# Altium project Current Sense.PrjPcb
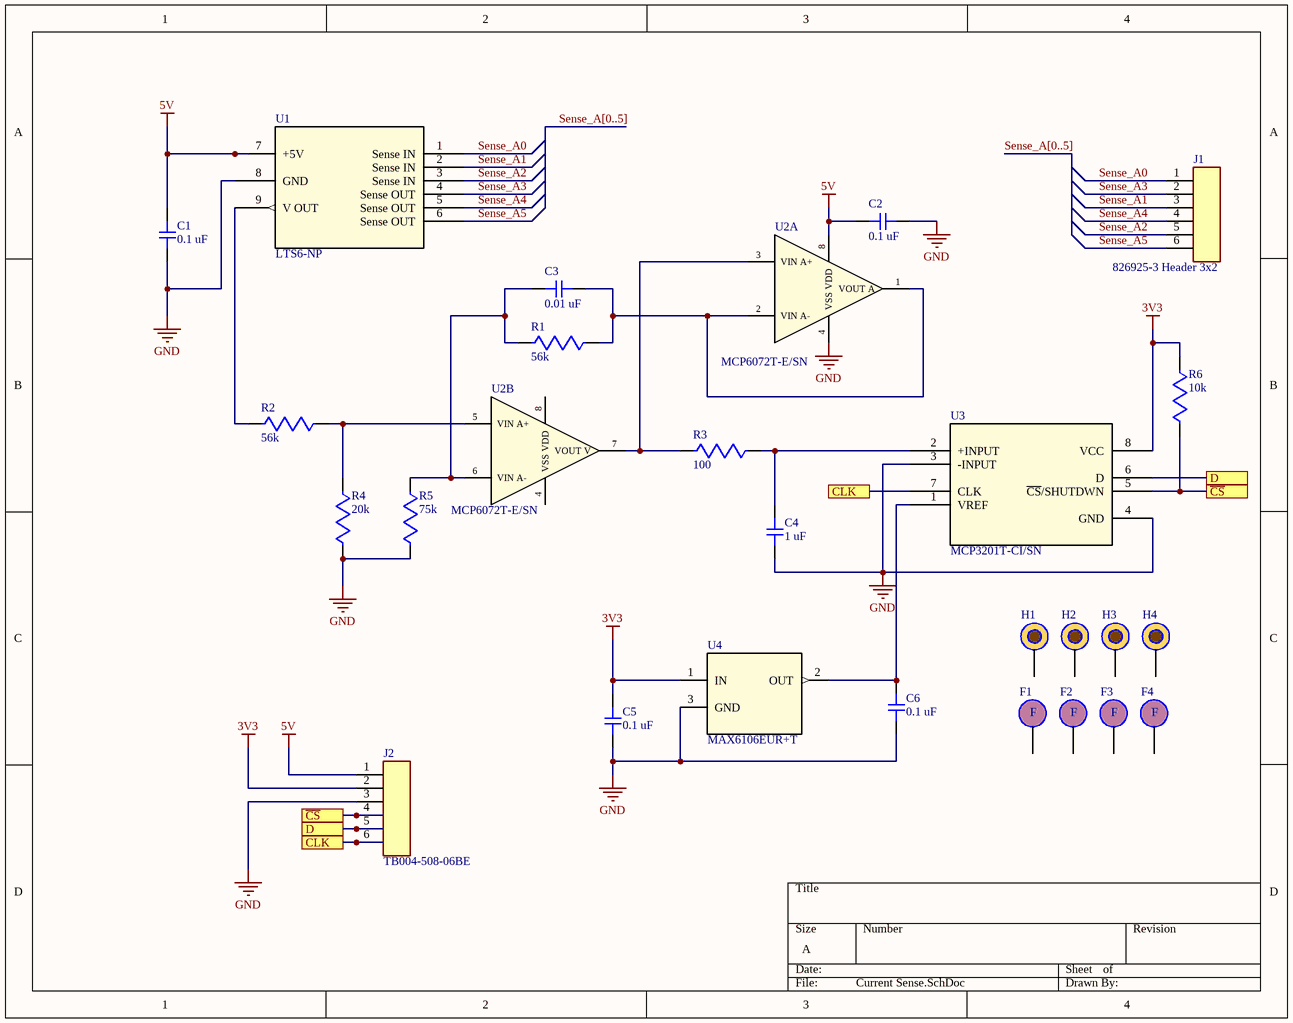
[diagram p0: Current Sense.SchDoc]
1 sheet, 26 parts. Net scope: flat (ports and power ports of the same name join across sheets).
Board file: Current Sense.PcbDoc

## Sheet Current Sense.SchDoc
size A

### Parts
C1  0.1 uF  [C0805E]
C2  0.1 uF  [C0805E]
C3  0.01 uF  [C0805E]
C4  1 uF  [C0805E]
C5  0.1 uF  [C0805E]
C6  0.1 uF  [C0805E]
F1  Fiducial 200mil  [FIDU_100mil]  (value not drawn)
F2  Fiducial 200mil  [FIDU_100mil]  (value not drawn)
F3  Fiducial 200mil  [FIDU_100mil]  (value not drawn)
F4  Fiducial 200mil  [FIDU_100mil]  (value not drawn)
H1  4-40 Hole  [4-40 Hole]  (value not drawn)
H2  4-40 Hole  [4-40 Hole]  (value not drawn)
H3  4-40 Hole  [4-40 Hole]  (value not drawn)
H4  4-40 Hole  [4-40 Hole]  (value not drawn)
J1  826925-3 Header 3x2  [TE_826925-3]
J2  TB004-508-06BE  [CUI_TB004-508-06BE]
R1  56k  [R0805E]
R2  56k  [R0805E]
R3  100  [R0805E]
R4  20k  [R0805E]
R5  75k  [R0805E]
R6  10k  [R0805E]
U1  LTS6-NP  [LTS 6-NP_LEM]
U2  MCP6072T-E/SN  [SOIC8-N_MC_MCH]  (parts A,B of 2)
U3  MCP3201T-CI/SN  [SOIC8-N_MC_MCH]
U4  MAX6106EUR+T  [21-0051H_MXM]

### Ports
CLK, D, ~{CS}

### Nets
3V3: C5.2 J2.2 R6.2 U3.8(VCC) U4.1(IN)
5V: C1.2 C2.2 J2.1 U1.7(+5V) U2.8(VDD)
GND: C1.1 C2.1 C4.1 C5.1 C6.1 J2.3 R4.2 R5.1 U1.8(GND) U2.4(VSS) U3.3(-INPUT) U3.4(GND) U4.3(GND)
Sense_A0: J1.1 U1.1(Sense_IN)
Sense_A1: J1.3 U1.2(Sense_IN)
Sense_A2: J1.5 U1.3(Sense_IN)
Sense_A3: J1.2 U1.4(Sense_OUT)
Sense_A4: J1.4 U1.5(Sense_OUT)
Sense_A5: J1.6 U1.6(Sense_OUT)
NetC3_1: C3.1 R1.1 R5.2 U2.6(VIN_A-)
NetC3_2: C3.2 R1.2 U2.1(VOUT_A) U2.2(VIN_A-)
NetC4_2: C4.2 R3.2 U3.2(+INPUT)
NetC6_2: C6.2 U3.1(VREF) U4.2(OUT)
NetJ2_4: J2.4 R6.1 U3.5(~{CS}/SHUTDWN) ; port ~{CS}
NetJ2_5: J2.5 U3.6(D) ; port D
NetJ2_6: J2.6 U3.7(CLK) ; port CLK
NetR2_1: R2.1 U1.9(V_OUT)
NetR2_2: R2.2 R4.1 U2.5(VIN_A+)
NetR3_1: R3.1 U2.3(VIN_A+) U2.7(VOUT_V)

Not connected (* = marked no-connect by the designer): F1 F; F2 F; F3 F; F4 F; H1 H; H2 H; H3 H; H4 H

### Buses and harness runs
bus Sense_A[0..5]

### Library data of the parts
C1 C2 C5 C6 = 08055C104JAT2A: 0805 100nF 50 V ±5 % Tolerance X7R Surface Mount Multilayer Ceramic Capacitor; Manufacturer: Kyocera AVX; Tolerance: 5%; Voltage Rating: 50V; Dissipation Factor: 2.5%; Insulation Resistance: 100GR; Supplier 1: Digi-Key; Supplier Part Number 1: 478-3352-1-ND; Manufacturer Part Number: 08055C104JAT2A; RoHS: Yes; Category: Ceramic Capacitors; Stock 1: 734747; Pricing 1: 1=0.12000, 10=0.08500, 50=0.04820, 100=0.03990, 500=0.02800, 1000=0.02318 (USD); Mount: Surface Mount,PCB; Case/Package: 0805; Number of Pins: 2; Case Code (Metric): 2012; Case Code (Imperial): 0805; Contact Plating: Tin,Matte; Dielectric Material: Ceramic; Min Operating Temperature: -55°C; Max Operating Temperature: 125°C; Capacitance: 100nF; Dielectric: X7R; Packaging: Tape and Reel; Package Quantity: 4000; Voltage Rating (DC): 50V; Termination: SMD/SMT; Voltage: 50V; Series: -; Construction: Flat; Length: 2.01mm; Width: 1.25mm; Height: 0.94mm; Depth: 1.25mm; Thickness: 0.037inch; Radiation Hardening: No; Reach SVHC Compliant: Yes; Lead Free: Lead Free; RoHS Compliant: Yes; ComponentLink1URL: https://datasheet.ciiva.com/27054/1929381-27054902.pdf?src-supplier=Jameco; ComponentLink1Description: https://datasheet.ciiva.com/27054/1929381-27054902.pdf?src-supplier=Jameco; ComponentLink2URL: https://datasheet.ciiva.com/16199/cx5r-16199661.pdf?src-supplier=Future+Electronics; ComponentLink2Description: https://datasheet.ciiva.com/16199/cx5r-16199661.pdf?src-supplier=Future+Electronics; ComponentLink3URL: https://datasheet.ciiva.com/15212/getdatasheetpartid-110198-15212571.pdf?src-supplier=Verical; ComponentLink3Description: https://datasheet.ciiva.com/15212/getdatasheetpartid-110198-15212571.pdf?src-supplier=Verical; ComponentLink4URL: https://datasheet.ciiva.com/7812/cx7r-7812074.pdf?src-supplier=Element14; ComponentLink4Description: https://datasheet.ciiva.com/7812/cx7r-7812074.pdf?src-supplier=Element14; ComponentLink5URL: https://datasheet.ciiva.com/7812/cx7r-7812075.pdf?src-supplier=Element14; ComponentLink5Description: https://datasheet.ciiva.com/7812/cx7r-7812075.pdf?src-supplier=Element14; ComponentLink6URL: https://datasheet.ciiva.com/7812/cx7r-7812076.pdf?src-supplier=Element14; ComponentLink6Description: https://datasheet.ciiva.com/7812/cx7r-7812076.pdf?src-supplier=Element14; ComponentLink7URL: https://datasheet.ciiva.com/28683/cx7r-28683529.pdf?src-supplier=Element14; ComponentLink7Description: https://datasheet.ciiva.com/28683/cx7r-28683529.pdf?src-supplier=Element14; ComponentLink8URL: https://datasheet.ciiva.com/150/cx7r-150564.pdf?src-supplier=Digi-Key; ComponentLink8Description: https://datasheet.ciiva.com/150/cx7r-150564.pdf?src-supplier=Digi-Key; ComponentLink9URL: https://datasheet.ciiva.com/150/cx7r-150563.pdf?src-supplier=Digi-Key; ComponentLink9Description: https://datasheet.ciiva.com/150/cx7r-150563.pdf?src-supplier=Digi-Key; ComponentLink10URL: https://datasheet.ciiva.com/150/cx7r-150565.pdf?src-supplier=Digi-Key; ComponentLink10Description: https://datasheet.ciiva.com/150/cx7r-150565.pdf?src-supplier=Digi-Key; ComponentLink11URL: https://datasheet.ciiva.com/14590/70001075-14590237.pdf?src-supplier=Allied+Electronics; ComponentLink11Description: https://datasheet.ciiva.com/14590/70001075-14590237.pdf?src-supplier=Allied+Electronics
C3 = 08051C103J4Z2A: 0805 0.01 uF 100 V ±5 % Tolerance X7R SMT Multilayer Ceramic Capacitor; Manufacturer: Kyocera AVX; Capacitance: 10nF; Voltage Rating: 100V; Tolerance: 5%; Supplier 1: Digi-Key; Supplier Part Number 1: 478-9933-1-ND; Manufacturer Part Number: 08051C103J4Z2A; RoHS: Yes; Category: Ceramic Capacitors; Stock 1: 228064; Pricing 1: 1=0.11000, 10=0.07500, 50=0.04240, 100=0.03510, 500=0.02464, 1000=0.02040 (USD); Mount: Surface Mount; Case/Package: 0805; Case Code (Metric): 2012; Case Code (Imperial): 0805; Min Operating Temperature: -55°C; Max Operating Temperature: 125°C; Packaging: Tape and Reel; Dielectric: X7R; Voltage Rating (DC): 100V; Features: Soft Termination; Length: 0.079inch; Width: 0.049inch; Thickness: 0.037inch; Ratings: AEC-Q200; RoHS Compliant: Yes; ComponentLink1URL: http://datasheets.avx.com/FlexitermMLCC.pdf?src-supplier=Digi-Key; ComponentLink1Description: http://datasheets.avx.com/FlexitermMLCC.pdf?src-supplier=Digi-Key
C4 = 08053C105JAT2A: 0805 1 uF 25 V ±5 % Tolerance X7R Surface Mount Multilayer Ceramic Capacitor; Manufacturer: Kyocera AVX; Capacitance: 1uF; Tolerance: 5%; Voltage Rating: 25V; Supplier 1: Digi-Key; Supplier Part Number 1: 478-10487-1-ND; Manufacturer Part Number: 08053C105JAT2A; RoHS: Yes; Category: Ceramic Capacitors; Stock 1: 90689; Pricing 1: 1=0.32000, 10=0.22200, 50=0.15560, 100=0.13330, 500=0.10000, 1000=0.08444 (USD); Mount: Surface Mount; Case/Package: 0805; Number of Pins: 2; Case Code (Metric): 2012; Case Code (Imperial): 0805; Contact Plating: Tin,Matte; Min Operating Temperature: -55°C; Max Operating Temperature: 125°C; Packaging: Tape and Reel; Package Quantity: 2000; Voltage Rating (DC): 25V; Dielectric: X7R; Termination: SMD/SMT; Construction: Flat; Series: -; Length: 2.01mm; Width: 0.049inch; Height: 1.4mm; Thickness: 0.037inch; Depth: 1.25mm; Radiation Hardening: No; Reach SVHC Compliant: Yes; Lead Free: Lead Free; RoHS Compliant: Yes; ComponentLink1URL: https://datasheet.ciiva.com/221/cx7r-221690.pdf?src-supplier=Digi-Key; ComponentLink1Description: https://datasheet.ciiva.com/221/cx7r-221690.pdf?src-supplier=Digi-Key; ComponentLink2URL: https://datasheet.ciiva.com/5419/cx7r-218113-5419770.pdf?src-supplier=Mouser; ComponentLink2Description: https://datasheet.ciiva.com/5419/cx7r-218113-5419770.pdf?src-supplier=Mouser; ComponentLink3URL: https://datasheet.ciiva.com/11499/cx7r-11499836.pdf?src-supplier=Avnet; ComponentLink3Description: https://datasheet.ciiva.com/11499/cx7r-11499836.pdf?src-supplier=Avnet; ComponentLink4URL: https://datasheet.ciiva.com/28586/1679506-28586091.pdf?src-supplier=Element14; ComponentLink4Description: https://datasheet.ciiva.com/28586/1679506-28586091.pdf?src-supplier=Element14
F1-F4 = FIDU_100mil
J1 = 826925-3: Conn Unshrouded Header HDR 6 POS 2.54mm Solder ST Thru-Hole Automotive Carton; Manufacturer: TE Connectivity; Number of Poles: 6; Current Rating: 3A; Connector Type: Plug,Header,Pin; Gender: Male; Board Standoff: No (Without); High Speed Serial Data Connector: No; PCB Mount Retention: Without; Contact Current Rating: 5A; Contact Post Length: 0.1259inch; Pin Length: 6.7mm; Plating Thickness: 2um; Supplier 1: Digi-Key; Supplier Part Number 1: A106478-ND; Manufacturer Part Number: 826925-3; RoHS: Yes; Category: Connectors; Stock 1: 9795; Pricing 1: 1=0.79000, 10=0.67100, 100=0.60220, 500=0.49268, 1000=0.43794, 5000=0.38319, 10000=0.36403 (USD); Mount: Through Hole; Contact Plating: Tin; Contact Material: Bronze; Color: Green; Housing Color: Green; Housing Material: PBT; Insulation Material: PBT; Contact Shape: Square; Contact Finish - Mating: TIN; Insulation Color: Green; Min Operating Temperature: -65°C; Max Operating Temperature: 105°C; Packaging: Carton; Number of Rows: 2; Contact Gender: Male; Package Quantity: 800; Number of Positions: 6; Termination: Through Hole; Number of Contacts: 6; Orientation: Straight; Contact Protection: No (Without); Gasket: No (Without); High Temperature Housing: No; Keyed: No; Mating Alignment: No (Without); Mating Connector Lock: No (Without); Selectively Loaded: No (Without); Stabilizers: No (Without); Strain Relief: No (Without); Series: AMPMODU MOD II; Contact Type: Male Pin; Fastening Type: Pull; Lead Pitch: 2.54mm; Pitch: 2.54mm; Row Spacing: 2.54mm; Contact Mating Length: 6.7mm; Depth: 5mm; Radiation Hardening: No; Reach SVHC Compliant: Yes; Flammability Rating: UL94 V-0; ELV: Compliant; Lead Free: Lead Free; RoHS Compliant: Yes; ComponentLink1URL: https://datasheet.ciiva.com/11749/0900766b80d7c469-11749304.pdf?src-supplier=RSComponents; ComponentLink1Description: https://datasheet.ciiva.com/11749/0900766b80d7c469-11749304.pdf?src-supplier=RSComponents; ComponentLink2URL: https://datasheet.ciiva.com/29369/001094812-da-01-en-stiftleiste-2-reihig-0-0826925-3-29369737.pdf?src-supplier=Conrad; ComponentLink2Description: https://datasheet.ciiva.com/29369/001094812-da-01-en-stiftleiste-2-reihig-0-0826925-3-29369737.pdf?src-supplier=Conrad; ComponentLink3URL: https://datasheet.ciiva.com/6856/eng-cd-826629-aa-basefilename-6856442.pdf?src-supplier=Digi-Key; ComponentLink3Description: https://datasheet.ciiva.com/6856/eng-cd-826629-aa-basefilename-6856442.pdf?src-supplier=Digi-Key; ComponentLink4URL: https://datasheet.ciiva.com/16403/eng-cd-826925-p-16403547.pdf?src-supplier=Future+Electronics; ComponentLink4Description: https://datasheet.ciiva.com/16403/eng-cd-826925-p-16403547.pdf?src-supplier=Future+Electronics; ComponentLink5URL: https://datasheet.ciiva.com/7800/38081-7800235.pdf?src-supplier=Element14; ComponentLink5Description: https://datasheet.ciiva.com/7800/38081-7800235.pdf?src-supplier=Element14
J2 = TB004-508-06BE: 2~24 Poles, Screw Type, Horizontal, 5.08 Pitch, 24~12 (AWG), Terminal Block Connector; Manufacturer: CUI; Supplier 1: Digi-Key; Supplier Part Number 1: 102-6183-ND; Manufacturer Part Number: TB004-508-06BE; RoHS: Yes
R1 R2 = RK73H2ATTD5602F: Res Thick Film 0805 56K Ohm 1% 0.25W(1/4W) ±100ppm/C Pad SMD Automotive T/R; Manufacturer: KOA Speer; Resistance: 56kR; Power Rating: 125mW; Voltage Rating: 150V; Temperature Coefficient: 100ppm/°C; Supplier 1: Digi-Key; Supplier Part Number 1: 2019-RK73H2ATTD5602FCT-ND; Manufacturer Part Number: RK73H2ATTD5602F; RoHS: Yes; Category: Chip SMD Resistors; Stock 1: 74990; Pricing 1: 1=0.10000, 10=0.03800, 100=0.01530, 1000=0.00688, 2500=0.00597 (USD); Case/Package: 0805; Number of Pins: 2; Case Code (Imperial): 0805; Case Code (Metric): 2012; Min Operating Temperature: -55°C; Max Operating Temperature: 155°C; Tolerance: 1%; Packaging: Tape and Reel; Package Quantity: 5000; Resistor Type: Thick Film; Termination: SMD/SMT; Series: RK73H; Construction: Rectangular; Resistance Tolerance: 1%; Length: 2mm; Width: 1.25mm; Height: 0.5mm; Depth: 1.25mm; Military Standard: Not; Lead Free: Lead Free; RoHS Compliant: Yes; ComponentLink1URL: https://datasheet.ciiva.com/7706/549017-7706126.pdf?src-supplier=Element14; ComponentLink1Description: https://datasheet.ciiva.com/7706/549017-7706126.pdf?src-supplier=Element14
R3 = RNCP0805FTD100R: Res Thin Film 0805 100 Ohm 1% 0.25W(1/4W) ±100ppm/C Sulfur Resistant Pad SMD T/R; Manufacturer: Stackpole Electronics; Resistance: 100R; Max Power Dissipation: 250mW; Temperature Coefficient: 100ppm/°C; Supplier 1: Digi-Key; Supplier Part Number 1: RNCP0805FTD100RCT-ND; Manufacturer Part Number: RNCP0805FTD100R; RoHS: Yes; Category: Chip SMD Resistors; Stock 1: 461793; Pricing 1: 1=0.10000, 10=0.07300, 100=0.02970, 500=0.01814, 1000=0.01336, 2500=0.01159 (USD); Mount: Surface Mount; Case/Package: 0805; Case Code (Metric): 2012; Case Code (Imperial): 0805; Min Operating Temperature: -55°C; Max Operating Temperature: 155°C; Tolerance: 1%; Packaging: Tape and Reel; Resistor Type: Thin Film; Number of Terminations: 2; Features: Moisture Resistant,Anti-Sulfur; Series: RNCP; Length: 0.079inch; Width: 0.049inch; Height: 0.024inch; Lead Free: Lead Free; RoHS Compliant: Yes; ComponentLink1URL: http://www.seielect.com/Catalog/SEI-rncp.pdf?src-supplier=Digi-Key; ComponentLink1Description: http://www.seielect.com/Catalog/SEI-rncp.pdf?src-supplier=Digi-Key; ComponentLink2URL: https://www.seielect.com/catalog/SEI-Packaging.pdf?src-supplier=Digi-Key; ComponentLink2Description: https://www.seielect.com/catalog/SEI-Packaging.pdf?src-supplier=Digi-Key
R4 = RNCP0805FTD20K0: Res Thin Film 0805 20K Ohm 1% 0.25W(1/4W) ±100ppm/C Sulfur Resistant Pad SMD T/R; Manufacturer: Stackpole Electronics; Resistance: 20kR; Max Power Dissipation: 250mW; Temperature Coefficient: 100ppm/°C; Supplier 1: Digi-Key; Supplier Part Number 1: RNCP0805FTD20K0CT-ND; Manufacturer Part Number: RNCP0805FTD20K0; RoHS: Yes; Category: Chip SMD Resistors; Stock 1: 159169; Pricing 1: 1=0.10000, 10=0.07300, 100=0.02970, 500=0.01814, 1000=0.01336, 2500=0.01159 (USD); Mount: Surface Mount; Case/Package: 0805; Case Code (Metric): 2012; Case Code (Imperial): 0805; Min Operating Temperature: -55°C; Max Operating Temperature: 155°C; Tolerance: 1%; Packaging: Tape and Reel; Resistor Type: Thin Film; Number of Terminations: 2; Features: Moisture Resistant,Anti-Sulfur; Series: RNCP; Length: 0.079inch; Width: 0.049inch; Height: 0.024inch; Lead Free: Lead Free; RoHS Compliant: Yes; ComponentLink1URL: https://www.seielect.com/catalog/SEI-Packaging.pdf?src-supplier=Digi-Key; ComponentLink1Description: https://www.seielect.com/catalog/SEI-Packaging.pdf?src-supplier=Digi-Key; ComponentLink2URL: http://www.seielect.com/Catalog/SEI-rncp.pdf?src-supplier=Digi-Key; ComponentLink2Description: http://www.seielect.com/Catalog/SEI-rncp.pdf?src-supplier=Digi-Key
R5 = RNCP0805FTD75K0: Res Thin Film 0805 75K Ohm 1% 0.25W(1/4W) ±100ppm/C Sulfur Resistant Pad SMD T/R; Manufacturer: Stackpole Electronics; Resistance: 75kR; Max Power Dissipation: 250mW; Temperature Coefficient: 100ppm/°C; Supplier 1: Digi-Key; Supplier Part Number 1: RNCP0805FTD75K0CT-ND; Manufacturer Part Number: RNCP0805FTD75K0; RoHS: Yes; Category: Chip SMD Resistors; Stock 1: 28880; Pricing 1: 1=0.10000, 10=0.07300, 100=0.02970, 500=0.01814, 1000=0.01336, 2500=0.01159 (USD); Mount: Surface Mount; Case/Package: 0805; Case Code (Metric): 2012; Case Code (Imperial): 0805; Min Operating Temperature: -55°C; Max Operating Temperature: 155°C; Packaging: Tape and Reel; Resistor Type: Thin Film; Number of Terminations: 2; Tolerance: 1%; Features: Moisture Resistant,Anti-Sulfur; Series: RNCP; Length: 0.079inch; Width: 0.049inch; Height: 0.024inch; RoHS Compliant: Yes; ComponentLink1URL: http://www.seielect.com/Catalog/SEI-rncp.pdf?src-supplier=Digi-Key; ComponentLink1Description: http://www.seielect.com/Catalog/SEI-rncp.pdf?src-supplier=Digi-Key
R6 = RNCP0805FTD10K0: Res Thin Film 0805 10K Ohm 1% 1/4W ±100ppm/°C Molded SMD Paper T/R; Manufacturer: Stackpole Electronics; Resistance: 10kR; Max Power Dissipation: 250mW; Supplier 1: Digi-Key; Supplier Part Number 1: RNCP0805FTD10K0CT-ND; Manufacturer Part Number: RNCP0805FTD10K0; RoHS: Yes; Category: Chip SMD Resistors; Stock 1: 596473; Pricing 1: 1=0.10000, 10=0.07300, 100=0.02970, 500=0.01814, 1000=0.01336, 2500=0.01159 (USD); Mount: Surface Mount; Case/Package: 0805; Case Code (Metric): 2012; Case Code (Imperial): 0805; Min Operating Temperature: -55°C; Max Operating Temperature: 155°C; Tolerance: 1%; Packaging: Tape and Reel; Resistor Type: Thin Film; Number of Terminations: 2; Temperature Coefficient: 100ppm/°C; Features: Moisture Resistant,Anti-Sulfur; Series: RNCP; Length: 0.079inch; Width: 0.049inch; Height: 0.024inch; Lead Free: Lead Free; RoHS Compliant: Yes; ComponentLink1URL: https://www.seielect.com/catalog/SEI-Packaging.pdf?src-supplier=Digi-Key; ComponentLink1Description: https://www.seielect.com/catalog/SEI-Packaging.pdf?src-supplier=Digi-Key
U1 = LTS6-NP: Sensor Current Hall 6A Ac/dc; Manufacturer: LEM; Frequency: 200kHz; Max Supply Voltage (DC): 5.25V; Operating Supply Voltage: 5V; Output Voltage: 2.5V; Number of Channels: 1; Response Time: 0.4us; Polarity: Bidirectional; Min Supply Voltage (DC): 4.75V; Linearity: 0.1%; Accuracy: 0.2%; Sensitivity: 104.16mV/A; Wire/Cable Diameter: 3.2mm; Supplier 1: Digi-Key; Supplier Part Number 1: 398-1000-ND; Manufacturer Part Number: LTS6-NP; RoHS: Yes; Category: Current Sensors; Stock 1: 150; Pricing 1: 1=18.62000, 5=18.24000, 10=15.20000, 25=14.06000, 50=13.68000, 100=11.78000 (USD); Mount: Through Hole,PCB; Min Operating Temperature: -40°C; Max Operating Temperature: 85°C; Package Quantity: 50; Packaging: Bulk; Current Sensing: 6A; Series: LTS; Current Rating: 6A; Height: 23.5mm; Reach SVHC Compliant: Yes; Lead Free: Lead Free; RoHS Compliant: Yes; ComponentLink1URL: https://datasheet.ciiva.com/2812/lts206-np-2812480.pdf?src-supplier=Digi-Key; ComponentLink1Description: https://datasheet.ciiva.com/2812/lts206-np-2812480.pdf?src-supplier=Digi-Key; ComponentLink2URL: https://datasheet.ciiva.com/3327/07696305-3327466.pdf?src-supplier=Distrelec; ComponentLink2Description: https://datasheet.ciiva.com/3327/07696305-3327466.pdf?src-supplier=Distrelec
U2 = MCP6072T-E/SN: Op Amp Dual Precision Amplifier R-R I/O 6V Automotive 8-Pin SOIC N T/R; Manufacturer: Microchip; Slew Rate: 0.5V/µs; Number of Circuits: 2; Gain Bandwidth Product: 1.2MHz; Input Bias Current: 100pA; Input Offset Voltage (Vos): 150uV; Operating Supply Current: 110uA; Common Mode Rejection Ratio: 72dB; Min Supply Voltage: 1.8V; Output Current: 28mA; Voltage Gain: 115dB; Power Supply Rejection Ratio (PSRR): 70dB; Amplifier Type: GENERAL PURPOSE; Supplier 1: Digi-Key; Supplier Part Number 1: MCP6072T-E/SNCT-ND; Manufacturer Part Number: MCP6072T-E/SN; RoHS: Yes; Category: Amplifiers - Op Amps, Buffer, Instrumentation; Stock 1: 94538; Pricing 1: 1=1.19000, 25=0.99640, 100=0.91500 (USD); Mount: Surface Mount; Case/Package: SOIC; Number of Pins: 8; Min Operating Temperature: -40°C; Max Operating Temperature: 125°C; Packaging: Tape and Reel; Unity Gain Bandwidth Product: 1.2MHz; Max Supply Voltage: 6V; Package Quantity: 3300; Number of Channels: 2; Nominal Supply Current: 110uA; Output Current per Channel: 28mA; Number of Elements: 2; Series: -; Supply Current: 110uA; Technology: CMOS; Input Offset Voltage-Max: 150uV; Slew Rate-Nom: 0.5V/µs; Radiation Hardening: No; Lead Free: Lead Free; RoHS Compliant: Yes; ComponentLink1URL: https://datasheet.ciiva.com/11711/22142-b-mcp6071-11711098.pdf?src-supplier=Avnet; ComponentLink1Description: https://datasheet.ciiva.com/11711/22142-b-mcp6071-11711098.pdf?src-supplier=Avnet; ComponentLink2URL: https://datasheet.ciiva.com/16450/filehandler-aspxddocname-en540513-16450534.pdf?src-supplier=Future+Electronics; ComponentLink2Description: https://datasheet.ciiva.com/16450/filehandler-aspxddocname-en540513-16450534.pdf?src-supplier=Future+Electronics; ComponentLink3URL: https://datasheet.ciiva.com/1793/22142-b-mcp6071-1793649.pdf?src-supplier=Digi-Key; ComponentLink3Description: https://datasheet.ciiva.com/1793/22142-b-mcp6071-1793649.pdf?src-supplier=Digi-Key
U3 = MCP3201T-CI/SN: 1-Channel Single ADC SAR 100ksps 12-bit Serial Automotive 8-Pin SOIC N T/R; Manufacturer: Microchip; Interface: SPI,Serial,3-WIRE; Number of Channels: 1; Operating Supply Voltage: 5V; Min Supply Voltage: 2.7V; Max Supply Voltage: 5.5V; Number of Bits: 12; Sampling Rate: 100KS/s; Resolution: 12b; Polarity: Unipolar; Integral Nonlinearity (INL): 2LSB; Full Scale Error: 5LSB; Differential Nonlinearity: 1LSB; Input Type: SINGLE-ENDED; Supplier 1: Digi-Key; Supplier Part Number 1: MCP3201T-CI/SNCT-ND; Manufacturer Part Number: MCP3201T-CI/SN; RoHS: Yes; Category: Analog to Digital Converters (ADCs); Stock 1: 15019; Pricing 1: 1=3.04000, 25=2.54400, 100=2.31080 (USD); Mount: Surface Mount; Case/Package: SOIC N; Number of Pins: 8; Contact Plating: Tin,Matte; Min Operating Temperature: -40°C; Max Operating Temperature: 85°C; Packaging: Tape and Reel; Package Quantity: 1; Number of Inputs: 1; Number of A/D Converters: 1; Number of Converters: 1; Number of Analog Inputs: 1; Number of Elements: 1; Conversion Rate: 100KS/s; Supply Type: Single; Radiation Hardening: No; Lead Free: Lead Free; RoHS Compliant: Yes; ComponentLink1URL: https://datasheet.ciiva.com/26923/getdatasheetpartid-786492-26923007.pdf?src-supplier=Verical; ComponentLink1Description: https://datasheet.ciiva.com/26923/getdatasheetpartid-786492-26923007.pdf?src-supplier=Verical; ComponentLink2URL: https://datasheet.ciiva.com/16389/filehandler-aspxddocname-en011279-16389286.pdf?src-supplier=Future+Electronics; ComponentLink2Description: https://datasheet.ciiva.com/16389/filehandler-aspxddocname-en011279-16389286.pdf?src-supplier=Future+Electronics; ComponentLink3URL: https://datasheet.ciiva.com/6666/21290f-6666382.pdf?src-supplier=Digi-Key; ComponentLink3Description: https://datasheet.ciiva.com/6666/21290f-6666382.pdf?src-supplier=Digi-Key
U4 = MAX6106EUR+T: MAX6106 Series 2.056 V ±0.4 % Surface Mount Series Voltage Reference - SOT-23; Manufacturer: Maxim; Output Voltage: 2.048V; Max Input Voltage: 12.6V; Max Output Current: 5mA; Min Input Voltage: 2.5V; Tolerance: 0.4%; Max Supply Current: 125uA; Temperature Coefficient: 75ppm/°C; Max Output Voltage: 2.056V; Reference Type: Series,Fixed; Output Type: Fixed; Supplier 1: Mouser; Supplier Part Number 1: 700-MAX6106EURT; Manufacturer Part Number: MAX6106EUR+T; RoHS: Yes; Category: Voltage References; Stock 1: 14807; Pricing 1: 1=1.47000, 10=1.33000, 50=1.25000, 100=1.07000, 1000=0.75000, 10000=0.72400 (USD); Mount: Surface Mount; Case/Package: SOT-23-3; Number of Pins: 3; Min Operating Temperature: -40°C; Max Operating Temperature: 85°C; Packaging: Tape and Reel; Package Quantity: 1; Min Output Voltage: 2.048V; Output Current: 5mA; Operating Supply Current: 125uA; Reference Voltage: 2.048V; Series: -; Length: 3.04mm; Width: 1.4mm; Height: 1.02mm; Radiation Hardening: No; RoHS Compliant: Yes; Lead Free: Lead Free; ComponentLink1URL: https://datasheet.ciiva.com/4908/max6100-max6107-87505-4908032.pdf?src-supplier=Mouser; ComponentLink1Description: https://datasheet.ciiva.com/4908/max6100-max6107-87505-4908032.pdf?src-supplier=Mouser; ComponentLink2URL: https://datasheet.ciiva.com/30476/0900766b811dea62-30476381.pdf?src-supplier=RSComponents; ComponentLink2Description: https://datasheet.ciiva.com/30476/0900766b811dea62-30476381.pdf?src-supplier=RSComponents; ComponentLink3URL: https://datasheet.ciiva.com/14198/max6100-max6107-14198841.pdf?src-supplier=Avnet; ComponentLink3Description: https://datasheet.ciiva.com/14198/max6100-max6107-14198841.pdf?src-supplier=Avnet; ComponentLink4URL: https://datasheet.ciiva.com/2008/max6100-max6107-2008213.pdf?src-supplier=Digi-Key; ComponentLink4Description: https://datasheet.ciiva.com/2008/max6100-max6107-2008213.pdf?src-supplier=Digi-Key